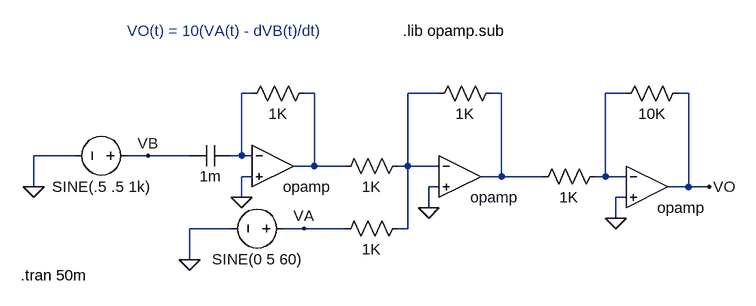
[diagram p0: schematic AMP19 - Projeto de Circuitos com Amplificadores.asc]
AMP19 - Projeto de Circuitos com Amplificadores.asc, the LTspice schematic file:
Version 4
SHEET 1 904 680
WIRE 144 32 128 32
WIRE 240 32 224 32
WIRE 432 32 384 32
WIRE 528 32 512 32
WIRE 720 32 688 32
WIRE 816 32 800 32
WIRE -128 128 -192 128
WIRE -16 128 -48 128
WIRE 48 128 -16 128
WIRE 128 128 128 32
WIRE 128 128 112 128
WIRE 144 128 128 128
WIRE 240 144 240 32
WIRE 240 144 208 144
WIRE 288 144 240 144
WIRE 384 144 384 32
WIRE 384 144 368 144
WIRE 432 144 384 144
WIRE 144 160 128 160
WIRE 528 160 528 32
WIRE 528 160 496 160
WIRE 592 160 528 160
WIRE 688 160 688 32
WIRE 688 160 672 160
WIRE 720 160 688 160
WIRE -192 176 -192 128
WIRE 432 176 416 176
WIRE 816 176 816 32
WIRE 816 176 784 176
WIRE 848 176 816 176
WIRE 128 192 128 160
WIRE 720 192 704 192
WIRE 416 208 416 176
WIRE 704 224 704 192
WIRE 112 240 48 240
WIRE 224 240 192 240
WIRE 288 240 224 240
WIRE 384 240 384 144
WIRE 384 240 368 240
WIRE 48 288 48 240
FLAG -16 128 VB
FLAG 128 192 0
FLAG 224 240 VA
FLAG 416 208 0
FLAG 704 224 0
FLAG 848 176 VO
FLAG -192 176 0
FLAG 48 288 0
SYMBOL Opamps\\opamp 176 80 R0
WINDOW 0 0 32 Invisible 2
SYMATTR InstName U1
SYMBOL cap 112 112 R90
WINDOW 0 0 32 Invisible 2
WINDOW 3 32 32 VTop 2
SYMATTR InstName C1
SYMATTR Value 1m
SYMBOL res 240 16 R90
WINDOW 0 0 56 Invisible 2
WINDOW 3 32 56 VTop 2
SYMATTR InstName R1
SYMATTR Value 1K
SYMBOL res 384 128 R90
WINDOW 0 0 56 Invisible 2
WINDOW 3 32 56 VTop 2
SYMATTR InstName R2
SYMATTR Value 1K
SYMBOL Opamps\\opamp 464 96 R0
WINDOW 0 0 32 Invisible 2
SYMATTR InstName U2
SYMBOL res 384 224 R90
WINDOW 0 0 56 Invisible 2
WINDOW 3 32 56 VTop 2
SYMATTR InstName R3
SYMATTR Value 1K
SYMBOL res 528 16 R90
WINDOW 0 0 56 Invisible 2
WINDOW 3 32 56 VTop 2
SYMATTR InstName R4
SYMATTR Value 1K
SYMBOL res 688 144 R90
WINDOW 0 0 56 Invisible 2
WINDOW 3 32 56 VTop 2
SYMATTR InstName R5
SYMATTR Value 1K
SYMBOL Opamps\\opamp 752 112 R0
WINDOW 0 0 32 Invisible 2
SYMATTR InstName U3
SYMBOL res 816 16 R90
WINDOW 0 0 56 Invisible 2
WINDOW 3 32 56 VTop 2
SYMATTR InstName R6
SYMATTR Value 10K
SYMBOL voltage -32 128 R90
WINDOW 0 -32 56 Invisible 2
WINDOW 3 32 56 VTop 2
WINDOW 123 0 0 Left 2
WINDOW 39 0 0 Left 2
SYMATTR InstName V1
SYMATTR Value SINE(.5 .5 1k)
SYMBOL voltage 208 240 R90
WINDOW 0 -32 56 Invisible 2
WINDOW 3 32 56 VTop 2
WINDOW 123 0 0 Left 2
WINDOW 39 0 0 Left 2
SYMATTR InstName V2
SYMATTR Value SINE(0 5 60)
TEXT 376 -64 Left 2 !.lib opamp.sub
TEXT -48 -64 Left 2 ;VO(t) = 10(VA(t) - dVB(t)/dt)
TEXT -212 312 Left 2 !.tran 50m

The netlist it stands for:
* AMP19 - Projeto de Circuitos com Amplificadores.asc
XU1 N001 0 N002 opamp Aol=100K GBW=10Meg  ; pins invin noninvin out
C1 N001 VB 1m
R1 N002 N001 1K
R2 N003 N002 1K
XU2 N003 0 N004 opamp Aol=100K GBW=10Meg  ; pins invin noninvin out
R3 N003 VA 1K
R4 N004 N003 1K
R5 N005 N004 1K
XU3 N005 0 VO opamp Aol=100K GBW=10Meg  ; pins invin noninvin out
R6 VO N005 10K
V1 VB 0 SINE(.5 .5 1k)
V2 VA 0 SINE(0 5 60)
.lib opamp.sub
* VO(t) = 10(VA(t) - dVB(t)/dt)
.tran 50m
.backanno
.end